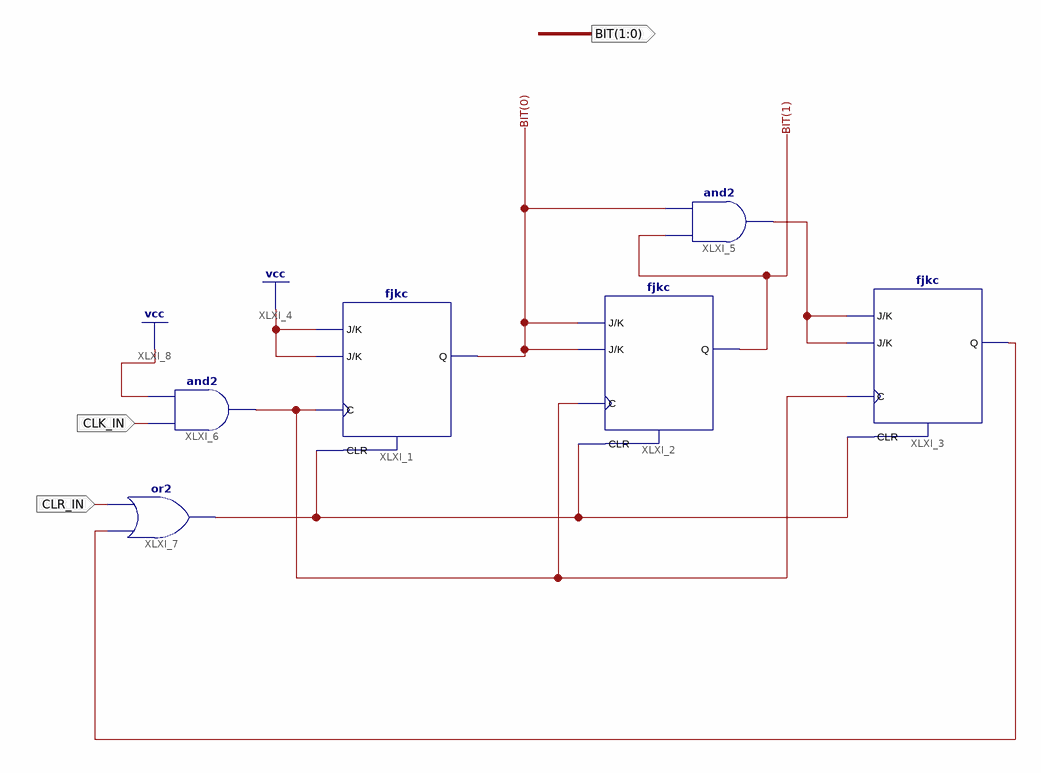
[diagram p0: schematic sheet 1]
// Xilinx ISE schematic counter03.sch (spartan6) as structural Verilog: 6 symbols, 3 ports
module counter03 (
  input  CLR_IN,
  input  CLK_IN,
  output [1:0] BIT
);

  wire XLXN_6, XLXN_10, XLXN_11, XLXN_15;

  fjkc XLXI_1 (.C(XLXN_10), .CLR(XLXN_11), .J(1'b1), .K(1'b1), .Q(BIT[0]));
  fjkc XLXI_2 (.C(XLXN_10), .CLR(XLXN_11), .J(BIT[0]), .K(BIT[0]), .Q(BIT[1]));
  fjkc XLXI_3 (.C(XLXN_10), .CLR(XLXN_11), .J(XLXN_6), .K(XLXN_6), .Q(XLXN_15));
  and XLXI_5 (XLXN_6, BIT[1], BIT[0]);
  and XLXI_6 (XLXN_10, CLK_IN, 1'b1);
  or XLXI_7 (XLXN_11, XLXN_15, CLR_IN);
endmodule
